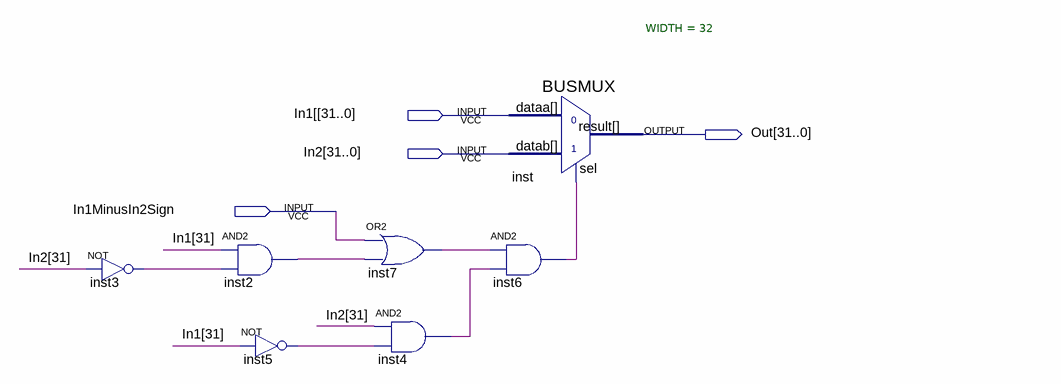
[diagram p0: schematic sheet]
// Quartus schematic Compare.bdf as structural Verilog: 7 symbols, 4 pins
module Compare (
  input  [31:0] \In1[ ,
  input  [31:0] In2,
  input  In1MinusIn2Sign,
  output [31:0] Out
);

  wire inst2_out, inst3_out, inst4_out, inst5_out, inst6_out, inst7_out;
  wire [31:31] In1;

  not inst3 (inst3_out, In2[31]);
  and inst2 (inst2_out, In1[31], inst3_out);
  not inst5 (inst5_out, In1[31]);
  or inst7 (inst7_out, In1MinusIn2Sign, inst2_out);
  and inst4 (inst4_out, In2[31], inst5_out);
  BUSMUX #(.WIDTH(32)) inst (.datab(In2), .sel(inst6_out), .dataa(\In1[ ), .result(Out));
  and inst6 (inst6_out, inst7_out, inst4_out);
endmodule
